# Altium schematic sheet LowCurrentSwitches.SchDoc
size A4
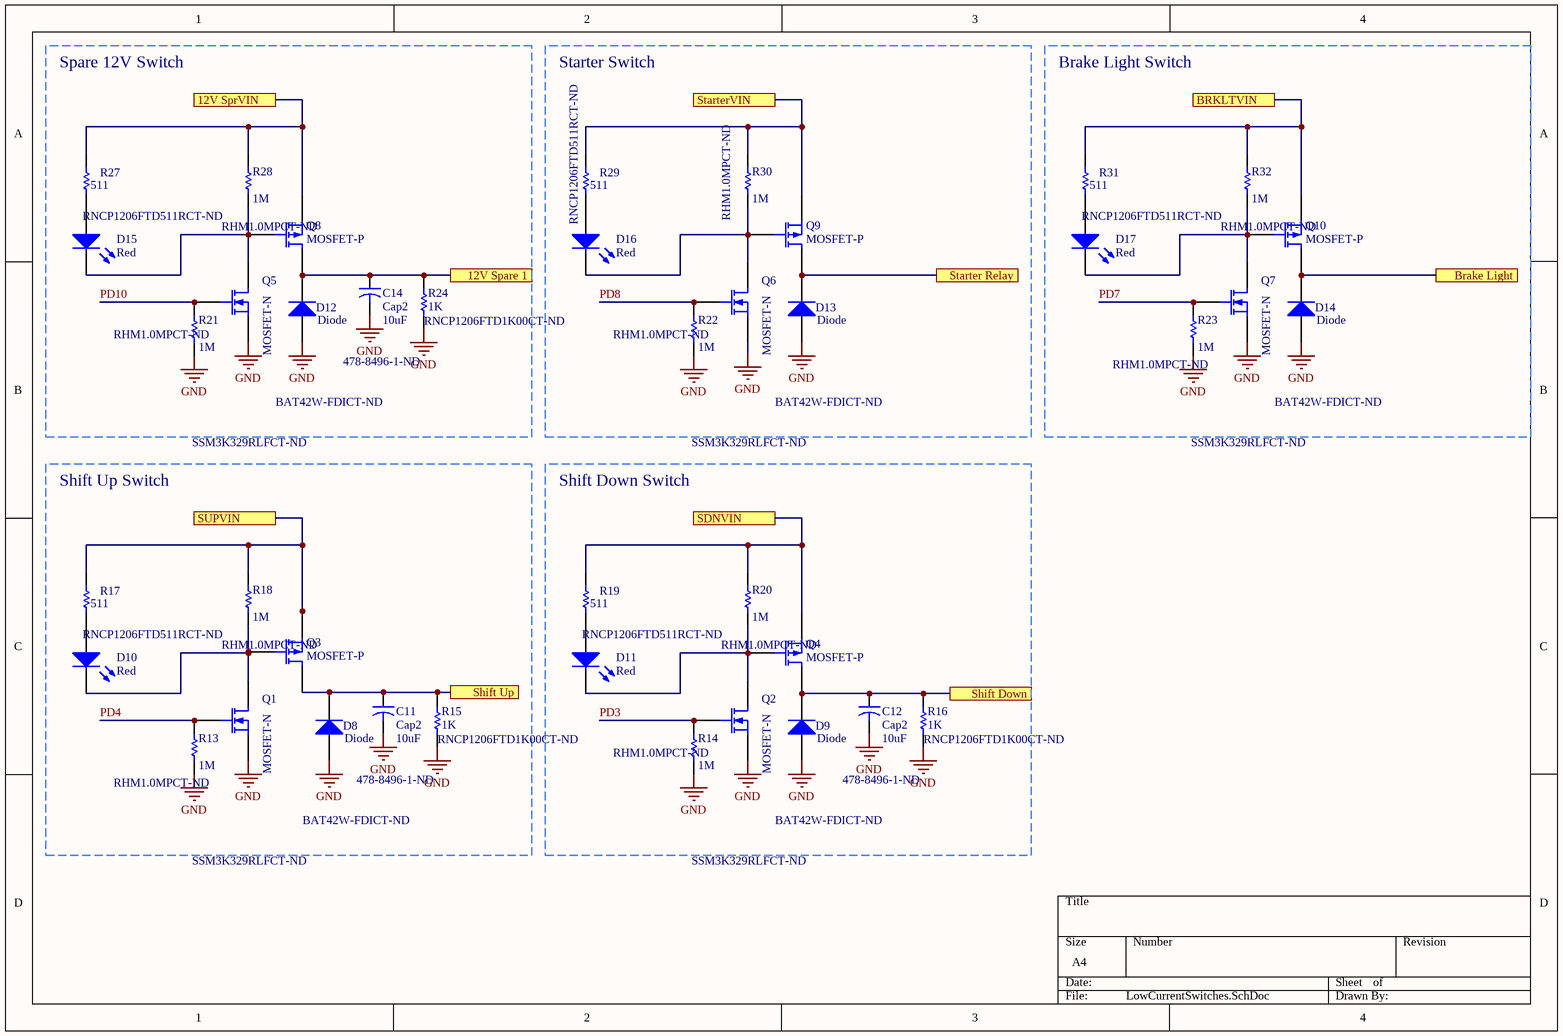
[diagram p0: LowCurrentSwitches.SchDoc]

## Parts
C11  Cap2  value 10uF  Supplier Part Number: 478-8496-1-ND  [PolCap1206]
C12  Cap2  value 10uF  Supplier Part Number: 478-8496-1-ND  [PolCap1206]
C14  Cap2  value 10uF  Supplier Part Number: 478-8496-1-ND  [PolCap1206]
D8  Diode  Supplier Part Number: BAT42W-FDICT-ND  [SOD123]
D9  Diode  Supplier Part Number: BAT42W-FDICT-ND  [SOD123]
D10  Red  [LEDC3216X120NRED]
D11  Red  [LEDC3216X120NRED]
D12  Diode  Supplier Part Number: BAT42W-FDICT-ND  [SOD123]
D13  Diode  Supplier Part Number: BAT42W-FDICT-ND  [SOD123]
D14  Diode  Supplier Part Number: BAT42W-FDICT-ND  [SOD123]
D15  Red  [LEDC3216X120NRED]
D16  Red  [LEDC3216X120NRED]
D17  Red  [LEDC3216X120NRED]
Q1  MOSFET-N  Supplier Part Number: SSM3K329RLFCT-ND  [SOT23-3]
Q2  MOSFET-N  Supplier Part Number: SSM3K329RLFCT-ND  [SOT23-3]
Q3  MOSFET-P  [SOT23-3]
Q4  MOSFET-P  [SOT23-3]
Q5  MOSFET-N  Supplier Part Number: SSM3K329RLFCT-ND  [SOT23-3]
Q6  MOSFET-N  Supplier Part Number: SSM3K329RLFCT-ND  [SOT23-3]
Q7  MOSFET-N  Supplier Part Number: SSM3K329RLFCT-ND  [SOT23-3]
Q8  MOSFET-P  [SOT23-3]
Q9  MOSFET-P  [SOT23-3]
Q10  MOSFET-P  [SOT23-3]
R13  value 1M  Supplier Part Number: RHM1.0MPCT-ND  [RESC3216X60N]  (hidden comment: 1206)
R14  value 1M  Supplier Part Number 1: RHM1.0MPCT-ND  [RESC3216X60N]  (hidden comment: 1206)
R15  1K  Supplier Part Number: RNCP1206FTD1K00CT-ND  [RESC3216X60N]
R16  1K  Supplier Part Number: RNCP1206FTD1K00CT-ND  [RESC3216X60N]
R17  511  Supplier Part Number: RNCP1206FTD511RCT-ND  [RESC3216X60N]
R18  value 1M  Supplier Part Number: RHM1.0MPCT-ND  [RESC3216X60N]  (hidden comment: 1206)
R19  511  Supplier Part Number: RNCP1206FTD511RCT-ND  [RESC3216X60N]
R20  value 1M  Supplier Part Number: RHM1.0MPCT-ND  [RESC3216X60N]  (hidden comment: 1206)
R21  value 1M  Supplier Part Number 1: RHM1.0MPCT-ND  [RESC3216X60N]  (hidden comment: 1206)
R22  value 1M  Supplier Part Number 1: RHM1.0MPCT-ND  [RESC3216X60N]  (hidden comment: 1206)
R23  value 1M  Supplier Part Number: RHM1.0MPCT-ND  [RESC3216X60N]  (hidden comment: 1206)
R24  1K  Supplier Part Number: RNCP1206FTD1K00CT-ND  [RESC3216X60N]
R27  511  Supplier Part Number: RNCP1206FTD511RCT-ND  [RESC3216X60N]
R28  value 1M  Supplier Part Number: RHM1.0MPCT-ND  [RESC3216X60N]  (hidden comment: 1206)
R29  511  Supplier Part Number: RNCP1206FTD511RCT-ND  [RESC3216X60N]
R30  value 1M  Supplier Part Number 1: RHM1.0MPCT-ND  [RESC3216X60N]  (hidden comment: 1206)
R31  511  Supplier Part Number: RNCP1206FTD511RCT-ND  [RESC3216X60N]
R32  value 1M  Supplier Part Number: RHM1.0MPCT-ND  [RESC3216X60N]  (hidden comment: 1206)

## Blocks framed on the sheet
Spare 12V Switch: C14 D12 D15 Q5 Q8 R21 R24 R27 R28
Starter Switch: D13 D16 Q6 Q9 R22 R29 R30
Brake Light Switch: D14 D17 Q7 Q10 R23 R31 R32
Shift Up Switch: C11 D8 D10 Q1 Q3 R13 R15 R17 R18
Shift Down Switch: C12 D9 D11 Q2 Q4 R14 R16 R19 R20

## Ports
12V Spare 1, 12V SprVIN, Brake Light, BRKLTVIN, SDNVIN, Shift Down, Shift Up, Starter Relay, StarterVIN, SUPVIN

## Nets
GND: C11.2 C12.2 C14.2 D8.1(A) D9.1(A) D12.1(A) D13.1(A) D14.1(A) Q1.3(S) Q2.3(S) Q5.3(S) Q6.3(S) Q7.3(S) R13.1 R14.1 R15.1 R16.1 R21.1 R22.1 R23.1 R24.1
12V Spare 1: C14.1 D12.2(K) Q8.1(D) R24.2 ; port 12V Spare 1
12V SprVIN: Q8.3(S) R27.1 R28.2 ; port 12V SprVIN
Brake Light: D14.2(K) Q10.1(D) ; port Brake Light
BRKLTVIN: Q10.3(S) R31.1 R32.2 ; port BRKLTVIN
PD3: Q2.2(G) R14.2
PD4: Q1.2(G) R13.2
PD7: Q7.2(G) R23.2
PD8: Q6.2(G) R22.2
PD10: Q5.2(G) R21.2
SDNVIN: Q4.3(S) R19.1 R20.2 ; port SDNVIN
Shift Down: C12.1 D9.2(K) Q4.1(D) R16.2 ; port Shift Down
Shift Up: C11.1 D8.2(K) Q3.1(D) R15.2 ; port Shift Up
Starter Relay: D13.2(K) Q9.1(D) ; port Starter Relay
StarterVIN: Q9.3(S) R29.1 R30.2 ; port StarterVIN
SUPVIN: Q3.3(S) R17.1 R18.2 ; port SUPVIN
NetD10_1: D10.1(A) R17.2
NetD10_2: D10.2(K) Q1.1(D) Q3.2(G) R18.1
NetD11_1: D11.1(A) R19.2
NetD11_2: D11.2(K) Q2.1(D) Q4.2(G) R20.1
NetD15_1: D15.1(A) R27.2
NetD15_2: D15.2(K) Q5.1(D) Q8.2(G) R28.1
NetD16_1: D16.1(A) R29.2
NetD16_2: D16.2(K) Q6.1(D) Q9.2(G) R30.1
NetD17_1: D17.1(A) R31.2
NetD17_2: D17.2(K) Q7.1(D) Q10.2(G) R32.1

## Library data of the parts
C11 C12 C14 = Cap2: Capacitor. Ceramic 10uF 50V rating recommended, place close to pin; Published: 23-Sep-2002; PackageReference: CAPR5-4X5; Publisher: Altium Limited; PackageDescription: Capacitor; 2 Leads; Supplier 1: Digi-Key
D8 D9 D12-D14 = Diode: Default Diode; Published: 8-Jun-2000; LatestRevisionDate: 17-Jul-2002; LatestRevisionNote: Re-released for DXP Platform.; PackageVersion: Sep-1996; PackageReference: SMC; Publisher: Altium Limited; PackageDescription: DO-214-AB/SMC; 2 C-Bend Leads; Body 7.9 x 5.9 mm, inc. leads (LxW); Code_JEDEC: DO-214-AB; Supplier 1: Digi-Key
D10 D11 D15-D17 = LED2_2: Typical RED, GREEN, YELLOW, AMBER GaAs LED; Manufacturer: Broadcom Avago; Manufacturer Part Number: HSMY-C150; Lens Colour: White,Clear; Viewing Angle: 170°; Lens Style: Diffused,Colorless,Rectangular; Wavelength: 586nm; Luminous Intensity: 8mcd; Forward Current: 20mA; Forward Voltage: 2.1V; Number of LEDs: 1; Reverse Voltage: 5V; Power Dissipation: 65mW; Lens Transparency: Diffused; Published: 8-Jun-2000; LatestRevisionDate: 17-Jul-2002; LatestRevisionNote: Re-released for DXP Platform.; PackageVersion: Feb-2002; PackageReference: 3.2X1.6X1.1; Publisher: Altium Limited; PackageDescription: SM LED; 2 Flat Leads; Supplier 1: Digi-Key; Stock 1: 0; Mount: Surface Mount; Case/Package: 1206; Number of Pins: 2; Colour: Red; Case Code (Metric): 3216; Case Code (Imperial): 1206; Contact Plating: Gold; Min Operating Temperature: -40°C; Max Operating Temperature: 85°C; Packaging: Tape and Reel; Package Quantity: 1; Illumination Colour: Red; Dominant Wavelength: 586nm; Test Current: 20mA; Number of Elements: 1; Power Rating: 65mW; Max Power Dissipation: 65mW; Voltage Rating (DC): 2.1V; Length: 3.2mm; Height: 1.1mm; Width: 1.6mm; Depth: 1.6mm; Radiation Hardening: No; REACH SVHC: No SVHC; Lead Free: Lead Free; ComponentLink1URL: https://datasheet.ciiva.com/15117/getdatasheetpartid-110528-15117488.pdf; ComponentLink1Description: https://datasheet.ciiva.com/15117/getdatasheetpartid-110528-15117488.pdf; ComponentLink2URL: https://datasheet.ciiva.com/11774/0900766b804a6539-11774578.pdf; ComponentLink2Description: https://datasheet.ciiva.com/11774/0900766b804a6539-11774578.pdf; ComponentLink3URL: https://datasheet.ciiva.com/19466/1557071-19466435.pdf; ComponentLink3Description: https://datasheet.ciiva.com/19466/1557071-19466435.pdf; ComponentLink4URL: https://datasheet.ciiva.com/14172/swseriehsmx-c150toc190-e-14172159.pdf; ComponentLink4Description: https://datasheet.ciiva.com/14172/swseriehsmx-c150toc190-e-14172159.pdf; ComponentLink5URL: https://datasheet.ciiva.com/29280/180507-da-01-en-chip-led-hsmy-c150-gelb-29280997.pdf; ComponentLink5Description: https://datasheet.ciiva.com/29280/180507-da-01-en-chip-led-hsmy-c150-gelb-29280997.pdf; Supplier 2: Digi-Key; Stock 2: 0; ComponentLink6URL: https://datasheet.ciiva.com/11773/0900766b804a6539-11773956.pdf; ComponentLink6Description: https://datasheet.ciiva.com/11773/0900766b804a6539-11773956.pdf; ComponentLink7URL: https://datasheet.ciiva.com/15117/getdatasheetpartid-142358-15117749.pdf; ComponentLink7Description: https://datasheet.ciiva.com/15117/getdatasheetpartid-142358-15117749.pdf; ComponentLink8URL: https://datasheet.ciiva.com/46426/313031-46426533.pdf; ComponentLink8Description: https://datasheet.ciiva.com/46426/313031-46426533.pdf; ComponentLink9URL: https://datasheet.ciiva.com/14172/swseriehsmx-c150toc190-e-14172156.pdf; ComponentLink9Description: https://datasheet.ciiva.com/14172/swseriehsmx-c150toc190-e-14172156.pdf; ComponentLink10URL: https://datasheet.ciiva.com/29281/180509-da-01-en-chip-led-hsmh-c150-rot-29281009.pdf; ComponentLink10Description: https://datasheet.ciiva.com/29281/180509-da-01-en-chip-led-hsmh-c150-rot-29281009.pdf; Supplier 3: Digi-Key; Supplier 4: Digi-Key; Supplier Part Number: 732-4992-1-ND
Q1 Q2 Q5-Q7 = MOSFET-N: N-Channel MOSFET; Published: 8-Jun-2000; LatestRevisionDate: 17-Jul-2002; LatestRevisionNote: Re-released for DXP Platform.; PackageVersion: 1995/1996; PackageReference: E3; Publisher: Altium Limited; PackageDescription: TO, Flat Index; 3 In-Line, Axial Leads; Body Dia. 4.6mm; Lead Dia. 0.5 mm (max); Supplier 1: Digi-Key
Q3 Q4 Q8-Q10 = MOSFET-P: P-Channel MOSFET; Published: 8-Jun-2000; LatestRevisionDate: 17-Jul-2002; LatestRevisionNote: Re-released for DXP Platform.; PackageVersion: 1995/1996; PackageReference: E3; Publisher: Altium Limited; PackageDescription: TO, Flat Index; 3 In-Line, Axial Leads; Body Dia. 4.6mm; Lead Dia. 0.5 mm (max); Supplier 1: Digi-Key; Supplier Part Number: DMP3099L-7DICT-ND
R13 R14 R17-R23 R27-R32 = Res1: Resistor; Published: 8-Jun-2000; LatestRevisionDate: 17-Jul-2002; LatestRevisionNote: Re-released for DXP Platform.; PackageReference: AXIAL-0.3; Publisher: Altium Limited; PackageDescription: Axial Device, Thru-Hole; 2 Leads; 0.3 in Pin Spacing; Supplier 1: Digi-Key
  R17 R19 R27 R29 R31: Value: 511
  R21 R30: Supplier Part Number: RHM1.0MPCT-ND
R15 R16 R24 = Res1: Resistor; Manufacturer: Stackpole Electronics; Manufacturer Part Number: RNCP1206FTD1K00; Resistance: 10kR; Tolerance: 1%; Temperature Coefficient: 100ppm/°C; Max Power Dissipation: 500mW; Value: 1K; Supplier 1: Digi-Key; Stock 1: 679; Pricing 1: 1=0.1, 10=0.052, 100=0.0211, 1000=0.00949, 2500=0.00824 (USD); Mount: Surface Mount; Case/Package: 1206; Case Code (Metric): 3216; Case Code (Imperial): 1206; Contact Plating: Nickel,Tin,Matte; Min Operating Temperature: -55°C; Max Operating Temperature: 155°C; Packaging: Tape and Reel; Composition: Thin Film; Number of Terminations: 2; Length: 0.122inch; Height: 0.024inch; Width: 0.059inch; Radiation Hardening: No; Lead Free: Lead Free; ComponentLink1URL: http://www.seielect.com/Catalog/SEI-rncp.pdf; ComponentLink1Description: http://www.seielect.com/Catalog/SEI-rncp.pdf; ComponentLink2URL: https://www.seielect.com/catalog/SEI-Packaging.pdf; ComponentLink2Description: https://www.seielect.com/catalog/SEI-Packaging.pdf